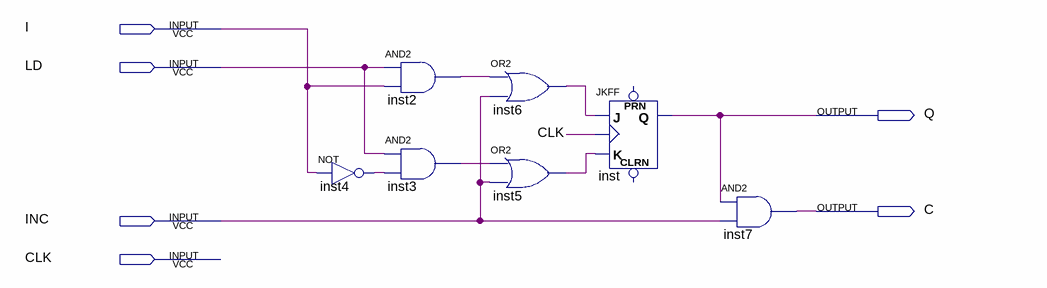
[diagram p0: schematic sheet]
// Quartus schematic REG1_LD_INC.bdf as structural Verilog: 7 symbols, 6 pins
module REG1_LD_INC (
  input  I,
  input  LD,
  input  INC,
  input  CLK,
  output Q,
  output C
);

  wire inst2_out, inst3_out, inst4_out, inst5_out, inst6_out;

  not inst4 (inst4_out, I);
  and inst2 (inst2_out, LD, I);
  and inst3 (inst3_out, LD, inst4_out);
  or inst6 (inst6_out, inst2_out, INC);
  or inst5 (inst5_out, inst3_out, INC);
  JKFF inst (.K(inst5_out), .J(inst6_out), .CLK(CLK), .Q(Q));  // open: PRN, CLRN
  and inst7 (C, Q, INC);
endmodule
